# EAGLE schematic schematicEagle (EAGLE 9.6.2)
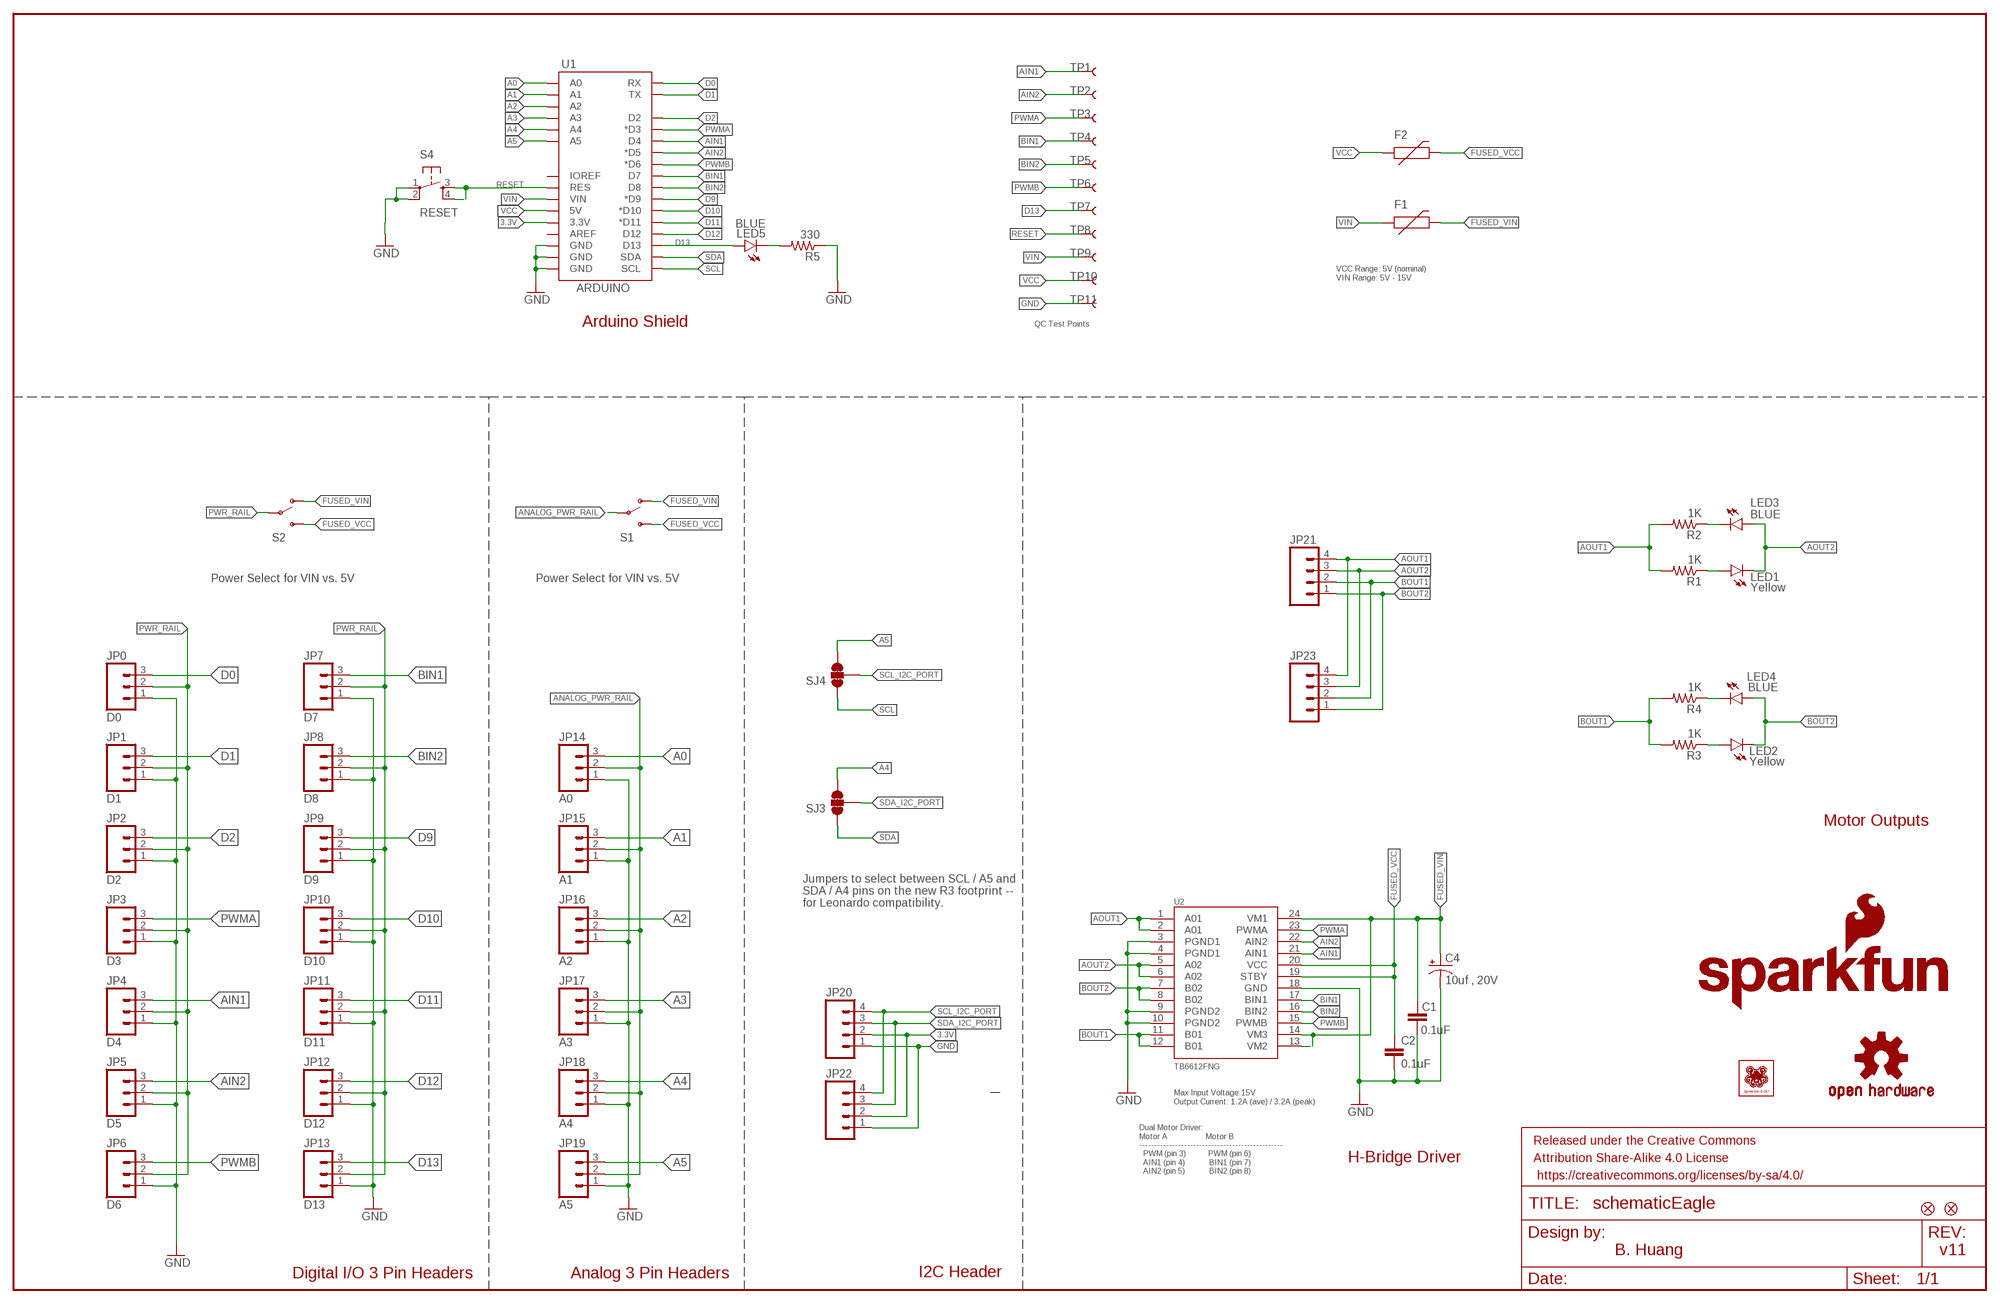
[diagram p0: schematic, sheet 1]

## Parts
C1  0.1uF  0.1UF-25V-5%(0603)  [0603-CAP]
C2  0.1uF  0.1UF-25V-5%(0603)  [0603-CAP]
C4  10uf , 20V  10UF-20V-10%(TANT)  [EIA3528]
F1  PTCSMD  [PTC-1206]
F2  PTCSMD  [PTC-1206]
FID1  FIDUCIAL1X2  [FIDUCIAL-1X2]
FID2  FIDUCIAL1X2  [FIDUCIAL-1X2]
FRAME2  FRAME-LEDGER  [CREATIVE_COMMONS]
JP0  D0  M03LOCK  [1X03_LOCK]
JP1  D1  M03LOCK  [1X03_LOCK]
JP2  D2  M03LOCK  [1X03_LOCK]
JP3  D3  M03LOCK  [1X03_LOCK]
JP4  D4  M03LOCK  [1X03_LOCK]
JP5  D5  M03LOCK  [1X03_LOCK]
JP6  D6  M03LOCK  [1X03_LOCK]
JP7  D7  M03LOCK  [1X03_LOCK]
JP8  D8  M03LOCK  [1X03_LOCK]
JP9  D9  M03LOCK  [1X03_LOCK]
JP10  D10  M03LOCK  [1X03_LOCK]
JP11  D11  M03LOCK  [1X03_LOCK]
JP12  D12  M03LOCK  [1X03_LOCK]
JP13  D13  M03LOCK  [1X03_LOCK]
JP14  A0  M03LOCK  [1X03_LOCK]
JP15  A1  M03LOCK  [1X03_LOCK]
JP16  A2  M03LOCK  [1X03_LOCK]
JP17  A3  M03LOCK  [1X03_LOCK]
JP18  A4  M03LOCK  [1X03_LOCK]
JP19  A5  M03LOCK  [1X03_LOCK]
JP20  M04PTH  [1X04]
JP21  M04PTH  [1X04]
JP22  M04LOCK  [1X04_LOCK]
JP23  M04LOCK  [1X04_LOCK]
LED1  Yellow  LED-YELLOW0603  [LED-0603]
LED2  Yellow  LED-YELLOW0603  [LED-0603]
LED3  BLUE  LED-BLUE0603  [LED-0603]
LED4  BLUE  LED-BLUE0603  [LED-0603]
LED5  BLUE  LED-BLUE0603  [LED-0603]
LOGO1  OSHW-LOGOM  [OSHW-LOGO-M]
LOGO2  SFE_LOGO_NAME_FLAME.1_INCH  [SFE_LOGO_NAME_FLAME_.1]
LOGO3  SFE_LOGO_FLAME.2COP  [SFE_LOGO_FLAME_COPPER_.2]
LOGO4  SFE_LOGO_NAME_FLAME.1_INCH  [SFE_LOGO_NAME_FLAME_.1]
R1  1K  1KOHM-1/10W-1%(0603)  [0603-RES]
R2  1K  1KOHM-1/10W-1%(0603)  [0603-RES]
R3  1K  1KOHM-1/10W-1%(0603)  [0603-RES]
R4  1K  1KOHM-1/10W-1%(0603)  [0603-RES]
R5  330  330OHM1/10W1%(0603)  [0603-RES]
S1  SWITCH-SPDTSMD  [AYZ0202]
S2  SWITCH-SPDTSMD  [AYZ0202]
S4  RESET  TAC_SWITCHSMD  [TACTILE-SWITCH-SMD]
SJ3  JUMPER-PAD-3-NC_BY_TRACE  [PAD-JUMPER-3-3OF3_NC_BY_TRACE_YES_SILK_FULL_BOX]
SJ4  JUMPER-PAD-3-NC_BY_TRACE  [PAD-JUMPER-3-3OF3_NC_BY_TRACE_YES_SILK_FULL_BOX]
TP1  TEST-POINT3X5  [PAD.03X.05]
TP2  TEST-POINT3X5  [PAD.03X.05]
TP3  TEST-POINT3X5  [PAD.03X.05]
TP4  TEST-POINT3X5  [PAD.03X.05]
TP5  TEST-POINT3X5  [PAD.03X.05]
TP6  TEST-POINT3X5  [PAD.03X.05]
TP7  TEST-POINT3X5  [PAD.03X.05]
TP8  TEST-POINT3X5  [PAD.03X.05]
TP9  TEST-POINT3X5  [PAD.03X.05]
TP10  TEST-POINT3X5  [PAD.03X.05]
TP11  TEST-POINT3X5  [PAD.03X.05]
U1  ARDUINO  ARDUINO_R3_SHIELDUNO_R3_SHIELD_NOLABELS_LOCK  [UNO_R3_SHIELD_NOLABELS_LOCK]
U2  TB6612FNG  [SSOP24]
U$1  SFE_LUDUSSFE_LUDUS-M  [SFE_LUDUS-M]

## Nets
3.3V: JP20.2 JP22.2 U1.3.3V
A0: JP14.3 U1.A0
A1: JP15.3 U1.A1
A2: JP16.3 U1.A2
A3: JP17.3 U1.A3
A4: JP18.3 SJ3.3 U1.A4
A5: JP19.3 SJ4.3 U1.A5
AIN1: JP4.3 TP1.P$1 U1.D4 U2.21(AIN1)
AIN2: JP5.3 TP2.P$1 U1.D5(*D5) U2.22(AIN2)
ANALOG_PWR_RAIL: JP14.2 JP15.2 JP16.2 JP17.2 JP18.2 JP19.2 S1.2(P)
AOUT1: JP21.4 JP23.4 R1.2 R2.2 U2.1(A01) U2.2(A01)
AOUT2: JP21.3 JP23.3 LED1.C LED3.A U2.5(A02) U2.6(A02)
BIN1: JP7.3 TP4.P$1 U1.D7 U2.17(BIN1)
BIN2: JP8.3 TP5.P$1 U1.D8 U2.16(BIN2)
BOUT1: JP21.2 JP23.2 R3.2 R4.2 U2.11(B01) U2.12(B01)
BOUT2: JP21.1 JP23.1 LED2.C LED4.A U2.7(B02) U2.8(B02)
D0: JP0.3 U1.RX
D1: JP1.3 U1.TX
D2: JP2.3 U1.D2
D9: JP9.3 U1.D9(*D9)
D10: JP10.3 U1.D10(*D10)
D11: JP11.3 U1.D11(*D11)
D12: JP12.3 U1.D12
D13: JP13.3 LED5.A TP7.P$1 U1.D13
FUSED_VCC: C2.1 F2.2 S1.3(S) S2.3(S) U2.19(STBY) U2.20(VCC)
FUSED_VIN: C1.1 C4.A(+) F1.2 S1.1(O) S2.1(O) U2.13(VM2) U2.14(VM3) U2.24(VM1)
GND: C1.2 C2.2 C4.C(-) JP0.1 JP1.1 JP2.1 JP3.1 JP4.1 JP5.1 JP6.1 JP7.1 JP8.1 JP9.1 JP10.1 JP11.1 JP12.1 JP13.1 JP14.1 JP15.1 JP16.1 JP17.1 JP18.1 JP19.1 JP20.1 JP22.1 R5.1 S4.1 S4.2 TP11.P$1 U1.GND@0(GND) U1.GND@1(GND) U1.GND@2(GND) U2.3(PGND1) U2.4(PGND1) U2.9(PGND2) U2.10(PGND2) U2.18(GND)
N$1: LED5.C R5.2
N$4: LED1.A R1.1
N$5: LED3.C R2.1
N$8: LED2.A R3.1
N$9: LED4.C R4.1
PWMA: JP3.3 TP3.P$1 U1.D3(*D3) U2.23(PWMA)
PWMB: JP6.3 TP6.P$1 U1.D6(*D6) U2.15(PWMB)
PWR_RAIL: JP0.2 JP1.2 JP2.2 JP3.2 JP4.2 JP5.2 JP6.2 JP7.2 JP8.2 JP9.2 JP10.2 JP11.2 JP12.2 JP13.2 S2.2(P)
RESET: S4.3 S4.4 TP8.P$1 U1.RES
SCL: SJ4.1 U1.SCL
SCL_I2C_PORT: JP20.4 JP22.4 SJ4.2
SDA: SJ3.1 U1.SDA
SDA_I2C_PORT: JP20.3 JP22.3 SJ3.2
VCC: F2.1 TP10.P$1 U1.5V
VIN: F1.1 TP9.P$1 U1.VIN
Unconnected: U1.AREF U1.IOREF

## Notes on the sheet
- VCC Range: 5V (nominal)
  VIN Range: 5V - 15V
- Arduino Shield | QC Test Points
- Power Select for VIN vs. 5V | Power Select for VIN vs. 5V
- Motor Outputs
- Jumpers to select between SCL / A5 and 
  SDA / A4 pins on the new R3 footprint --
  for Leonardo compatibility.
- Max Input Voltage:15V
  Output Current: 1.2A (ave) / 3.2A (peak)
- H-Bridge Driver
- Dual Motor Driver:
  Motor A                   Motor B
  ------------------------------------------------
    PWM (pin 3)           PWM (pin 6) 
    AIN1 (pin 4)            BIN1 (pin 7)
    AIN2 (pin 5)            BIN2 (pin 8)
- B. Huang | v11
- Digital I/O 3 Pin Headers | Analog 3 Pin Headers | I2C Header

## Library data of the parts
C1 C2 = SparkFun-Capacitors:0.1UF-25V-5%(0603): CAP-08604; PROD_ID: CAP-08604
C4 = SparkFun-Capacitors:10UF-20V-10%(TANT): CAP-08063; PROD_ID: CAP-08063; VALUE: 10uF
F1 F2 = SparkFun-PowerIC:PTC: Resettable Fuse PTC Resettable Fuse. Spark Fun Electronics SKU : COM-08357; PROD_ID: RES-11150
FID1 FID2 = SparkFun-Aesthetics:FIDUCIAL: Fiducial Alignment Points Various fiducial points for machine vision alignment.
FRAME2 = SparkFun-Aesthetics:FRAME-LEDGER: Schematic Frame Standard 11x14 US Ledger frame
JP0 JP1-JP19 = SparkFun-Connectors:M03: Header 3 Standard 3-pin 0.1" header. Use with straight break away headers (SKU : PRT-00116), right angle break away headers (PRT-00553), swiss pins (PRT-00743), machine pins (PRT-00117), and female headers (PRT-00115). Molex polarized connector foot print use with SKU : PRT-08232 with associated crimp pins and housings.
JP20-JP23 = SparkFun-Connectors:M04: Header 4 Standard 4-pin 0.1" header. Use with straight break away headers (SKU : PRT-00116), right angle break away headers (PRT-00553), swiss pins (PRT-00743), machine pins (PRT-00117), and female headers (PRT-00115). Molex polarized connector foot print use with SKU : PRT-08231 with associated crimp pins and housings. 1MM SMD Version SKU: PRT-10208
LED1 LED2 = SparkFun-LED:LED-YELLOW: Yellow SMD LEDs LilyPad 1206- DIO-09909 0603- DIO-09003; PROD_ID: DIO-09003
LED3-LED5 = SparkFun-LED:LED-BLUE: Blue LEDs for production use Various blue LEDs stocked by SparkFun production 0603 - DIO-08575 Rebel - DIO-09553 1206 - DIO-09911; PROD_ID: DIO-08575
LOGO1 = SparkFun-Aesthetics:OSHW-LOGO: Open Source Hardware Logo This logo indicates the piece of hardware it is found on incorporates a OSHW license and/or adheres to the definition of open source hardware found here: http://freedomdefined.org/OSHW
LOGO2 LOGO4 = SparkFun-Aesthetics:SFE_LOGO_NAME_FLAME: SFE Logo, name and flame This is the SparkFun full logo. The logo on the schematic will always be the same size; the package variant is the height of the flame part of the logo. Default layer for the logo on the board is tSilk.
LOGO3 = SparkFun-Aesthetics:SFE_LOGO_FLAME: SFE Logo, flame only This is the SparkFun flame logo. The logo on the schematic will always be the same size; the package variant is the height of the flame. Default layer for the logo on the board is tSilk.
R1-R4 = SparkFun-Resistors:1KOHM-1/10W-1%(0603): RES-07856; PROD_ID: RES-07856
R5 = SparkFun-Resistors:330OHM1/10W1%(0603): RES-00818; PROD_ID: RES-00818
S1 S2 = SparkFun-Electromechanical:SWITCH-SPDT: SPDT Switch Simple slide switch, Spark Fun Electronics SKU : COM-00102 DPDT SMT slide switch, AYZ0202, SWCH-08179; PROD_ID: SWCH-08179
S4 = SparkFun-Electromechanical:TAC_SWITCH: Momentary Switch Button commonly used for reset or general input. Spark Fun Electronics SKU : COM-00097 SMT- SWCH-08247; PROD_ID: SWCH-08247; VALUE: TAC_SWITCHSMD
SJ3 SJ4 = SparkFun-Passives:JUMPER-PAD-3-NC_BY_TRACE
TP1-TP11 = SparkFun-Passives:TEST-POINT: Bare copper test points for troubleshooting or ICT
U1 = SparkFun-Boards:ARDUINO_R3_SHIELD: Shield form compatible with the Arduino Uno R3.
U2 = SparkFun-PowerIC:TB6612FNG: Toshiba 1A dual motor driver IC-09363; PROD_ID: IC-09363
U$1 = SparkFun-Aesthetics:SFE_LUDUS

## Net classes
1 power: width 0.61 mm